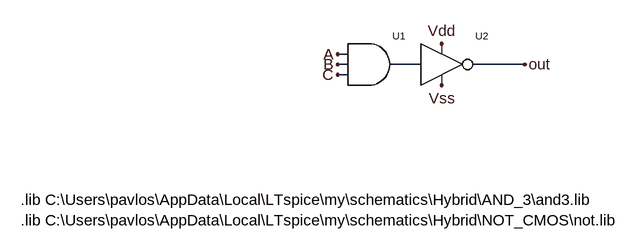
[diagram p0: schematic nand3.asc]
nand3.asc, the LTspice schematic file:
Version 4
SHEET 1 880 680
WIRE -160 -96 -176 -96
WIRE -16 -96 -16 -112
WIRE -160 -80 -176 -80
WIRE -48 -80 -96 -80
WIRE 112 -80 32 -80
WIRE -160 -64 -176 -64
WIRE -16 -48 -16 -64
FLAG 112 -80 out
FLAG -176 -80 B
FLAG -176 -96 A
FLAG -176 -64 C
FLAG -16 -48 Vss
FLAG -16 -112 Vdd
SYMBOL and3 -160 -48 R0
SYMATTR InstName U1
SYMBOL not -48 -48 R0
SYMATTR InstName U2
TEXT -664 128 Left 2 !.lib C:\\Users\\pavlos\\AppData\\Local\\LTspice\\my\\schematics\\Hybrid\\AND_3\\and3.lib
TEXT -664 160 Left 2 !.lib C:\\Users\\pavlos\\AppData\\Local\\LTspice\\my\\schematics\\Hybrid\\NOT_CMOS\\not.lib

The netlist it stands for:
* nand3.asc
XU1 A C B N001 and3  ; pins A B C Y
XU2 N001 out Vdd Vss not  ; pins A Y Vdd Vss
.lib C:\Users\pavlos\AppData\Local\LTspice\my\schematics\Hybrid\AND_3\and3.lib
.lib C:\Users\pavlos\AppData\Local\LTspice\my\schematics\Hybrid\NOT_CMOS\not.lib
.backanno
.end